# Altium project WPT 5V DC DC Converter Round 1.PrjPcb
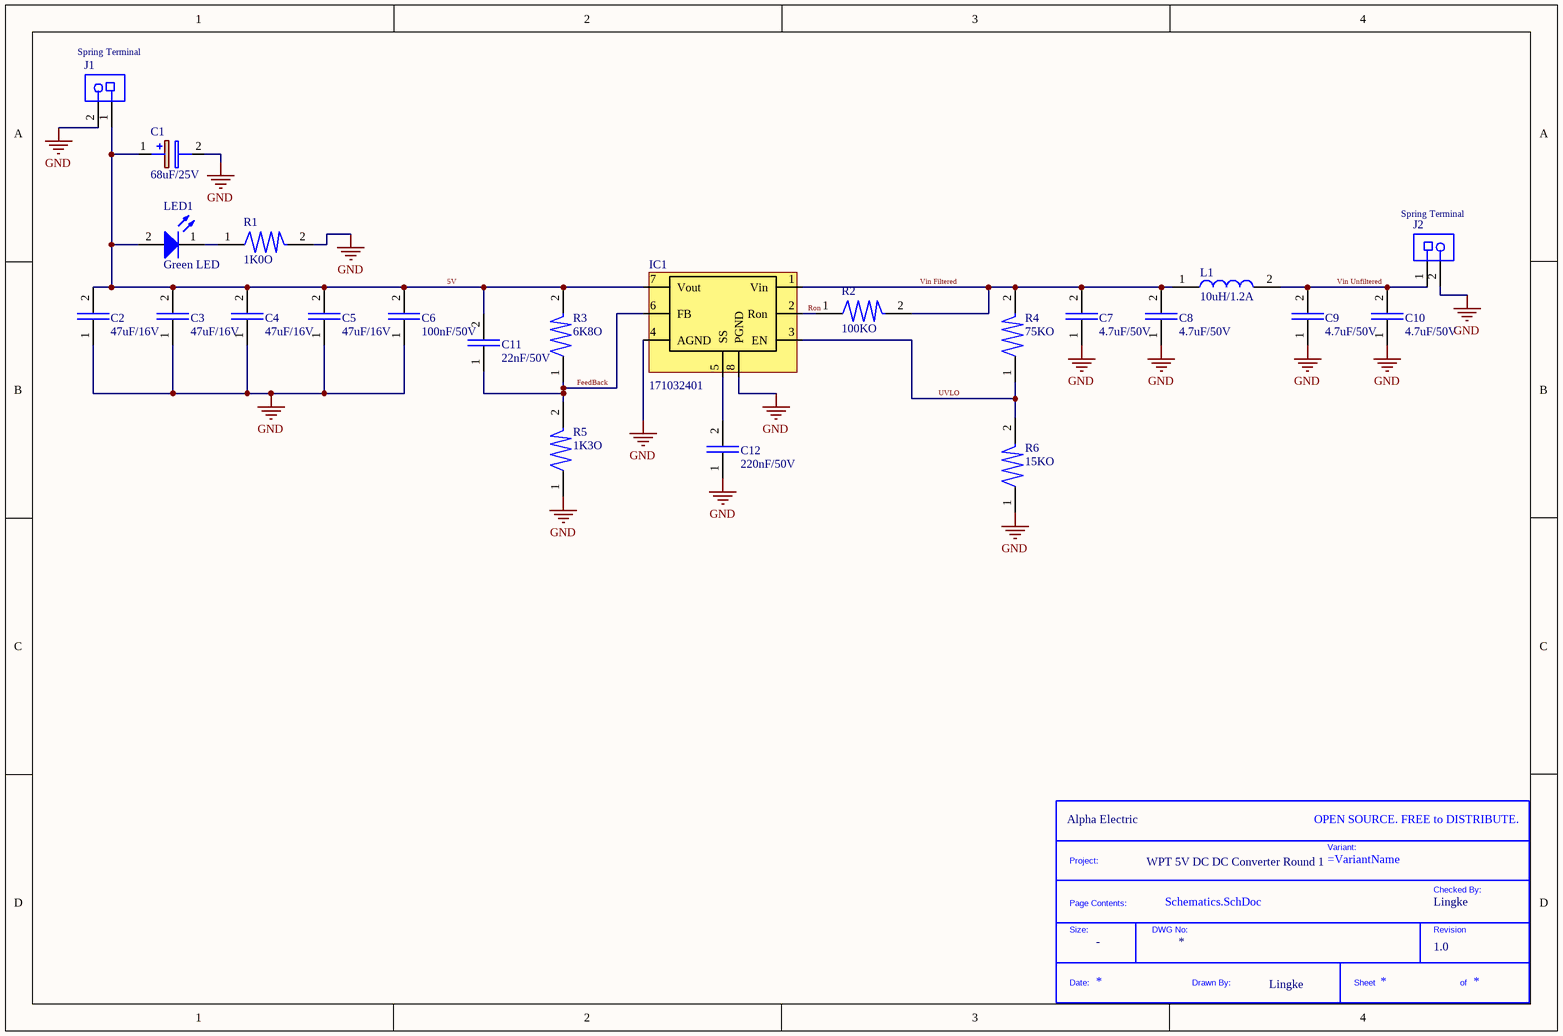
[diagram p0: Schematics.SchDoc]
1 sheet, 24 parts. Net scope: global (net labels, ports and power ports of the same name join across sheets).
Board file: Layout.PcbDoc

## Sheet Schematics.SchDoc
size A4

### Parts
*  Project Name: WPT 5V DC DC Converter Round 1  Company: Alpha Electric  Drawn By: Lingke  Revision: 1.0  (hidden comment: Title_Block)  (no BOM)
C1  68uF/25V  [CAPAE830X1170N]
C2  47uF/16V  [CAPC3225X280N]
C3  47uF/16V  [CAPC3225X280N]
C4  47uF/16V  [CAPC3225X280N]
C5  47uF/16V  [CAPC3225X280N]
C6  100nF/50V  [CAPC3216X90N]
C7  4.7uF/50V  [CAPC3225X280N]
C8  4.7uF/50V  [CAPC3225X280N]
C9  4.7uF/50V  [CAPC3225X280N]
C10  4.7uF/50V  [CAPC3225X280N]
C11  22nF/50V  [CAPC2012X90N]
C12  220nF/50V  [CAPC2012X90N]
IC1  171032401  [7 PIN PFM]
J1  Spring Terminal  [691411510002]
J2  Spring Terminal  [691411510002]
L1  10uH/1.2A  [WE-MAPI_3020]
LED1  Green LED  [0805_A]
R1  1K0O  [FP-CRCW0805-e3-MFG]
R2  100KO  [FP-CRCW0805-e3-MFG]
R3  6K8O  [FP-CRCW0805-e3-MFG]
R4  75KO  [FP-CRCW0805-e3-MFG]
R5  1K3O  [FP-CRCW0805-e3-MFG]
R6  15KO  [FP-CRCW0805-e3-MFG]

### Nets
GND: C1.2(-) C2.1 C3.1 C4.1 C5.1 C6.1 C7.1 C8.1 C9.1 C10.1 C12.1 IC1.4(AGND) IC1.8(PGND) J1.2 J2.2 R1.2 R5.1 R6.1
5V: C1.1(+) C2.2 C3.2 C4.2 C5.2 C6.2 C11.2 IC1.7(Vout) J1.1 LED1.2(A) R3.2
FeedBack: C11.1 IC1.6(FB) R3.1 R5.2
Ron: IC1.2(Ron) R2.1
UVLO: IC1.3(EN) R4.1 R6.2
Vin Filtered: C7.2 C8.2 IC1.1(Vin) L1.1 R2.2 R4.2
Vin Unfiltered: C9.2 C10.2 J2.1 L1.2
NetC12_2: C12.2 IC1.5(SS)
NetLED1_1: LED1.1(K) R1.1

### Notes on the sheet
- (in symbol Title_Block) OPEN SOURCE. FREE to DISTRIBUTE.; Variant:; Project:; Checked By:; Page Contents:; Size:; DWG No:; Revision; Date:; Drawn By:; Sheet; of

### Library data of the parts
* = Title_Block: Standard Title Block.; DWG No: *; Size: -; Checked By: Lingke
C1 = 875075555003: Capacitor Polarised; Manufacturer_Name: Wurth Elektronik; Datasheet Link: http://katalog.we-online.com/pbs/datasheet/875075555003.pdf; Height: 11.7mm; Manufacturer_Part_Number: 875075555003; Supplier 1: Mouser; Supplier Part Number 1: 710-875075555003
C2-C5 = EMK325ABJ476MMHP: Capacitor 47uF/16V; Supplier 1: Mouser; Supplier Part Number 1: 963-EMK325ABJ476MMHP
C6 = 885012208087: Capacitor 100nF/50V; Manufacturer_Name: Wurth Elektronik; Datasheet Link: https://componentsearchengine.com//885012208087.pdf; Height: 0.9mm; Mouser2 Part Number: 710-885012208087; Mouser2 Price/Stock: https://www.mouser.com/Search/Refine.aspx?Keyword=710-885012208087; Manufacturer_Part_Number: 885012208087; Supplier 1: Mouser; Supplier Part Number 1: 710-885012208087
C7-C10 = 885012209048: Capacitor 4.7uF/50V; Manufacturer_Name: Wurth Elektronik; Datasheet Link: https://katalog.we-online.com/pbs/datasheet/885012209048.pdf; Height: 2.8mm; Manufacturer_Part_Number: 885012209048; Supplier 1: Mouser; Supplier Part Number 1: 710-885012209048
C11 = 885012207094: Capacitor 22nF/50V; Manufacturer_Name: Wurth Elektronik; Datasheet Link: https://componentsearchengine.com//885012207094.pdf; Height: 0.9mm; Mouser2 Part Number: 710-885012207094; Mouser2 Price/Stock: https://www.mouser.com/Search/Refine.aspx?Keyword=710-885012207094; Manufacturer_Part_Number: 885012207094; Supplier 1: Mouser; Supplier Part Number 1: 710-885012207094
C12 = 885012207100: Capacitor 220nF / 50V; Supplier 1: Mouser; Supplier Part Number 1: 710-885012207100
IC1 = 171032401: MagI³C-VDRM Variable Step Down Regulator Module WE-VDRM , Ui=6-42V; Manufacturer: Wuerth Elektronik; Ui: 6-42 V; ComponentLink1Description: Manufacturer URL; ComponentLink2Description: Datasheet; ComponentLink1URL: http://www.we-online.com; ComponentLink2URL: http://katalog-live.we-online.de/pm/datasheet/171032401.pdf; PartNumber: 171032401; PackageReference: 7 PIN PFM; Supplier 1: Mouser; Supplier Part Number 1: 710-171032401
J1 J2 = 691411510002: Serie 4115 - 5.08mm Screwless Horizontal Entry WR-TBL, 2 pin; Manufacturer: Wurth Elektronik; Pin Number: 2; Datasheet URL: http://katalog.we-online.de/em/datasheet/6914115100XX.pdf; Part Number: 691411510002; Pitch: 5.08mm; Operating Temperature: -30to120degC; Packaging: Box; Package Reference: 691411510002; Publisher: WurthElektronik; Manufacturer URL: http://www.we-online.de; Mounting Technology: THT; Supplier 1: Mouser; Supplier Part Number 1: 710-691411510002
L1 = 74438336100: Inductor; Manufacturer_Name: Wurth Elektronik; Datasheet Link: http://katalog.we-online.de/pbs/datasheet/74438336100.pdf; Manufacturer_Part_Number: 74438336100; Supplier 1: Mouser; Supplier Part Number 1: 710-74438336100
LED1 = 150080GS75000: SMD mono-color Chip LED, WL-SMCW, Green; Manufacturer: Wuerth Elektronik; PackageReference: 0805_A; Color: Green; PartNumber: 150080GS75000; ComponentLink2URL: http://katalog.we-online.com/led/datasheet/150080GS75000.pdf; ComponentLink1URL: http://www.we-online.com; ComponentLink1Description: Manufacturer URL; ComponentLink2Description: Datasheet; Supplier 1: Mouser; Supplier Part Number 1: 710-150080GS75000
R1 = CRCW08051K00FKEAC: Resistor 1K0 Ohm; Number of Terminations: 2; Supplier 1: Mouser; Supplier Part Number 1: 71-CRCW0805-1.0K-E3
R2 = CRCW0805100KFKEB: Resistor 100K Ohm; Number of Terminations: 2; Supplier 1: Mouser; Supplier Part Number 1: 71-CRCW0805100KFKEB
R3 = CRCW08056K80FKEA: Resistor 6K8 Ohm; Number of Terminations: 2; Supplier 1: Mouser; Supplier Part Number 1: 71-CRCW0805-6.8K-E3
R4 = CRCW080575K0FKEB: Resistor 75K Ohm; Number of Terminations: 2; Supplier 1: Mouser; Supplier Part Number 1: 71-CRCW080575K0FKEB
R5 = CRCW08051K30FKEB: Resistor 1K3 Ohm; Number of Terminations: 2; Supplier 1: Mouser; Supplier Part Number 1: 71-CRCW08051K30FKEB
R6 = CRCW080515K0FKEB: Resistor 15K Ohm; Number of Terminations: 2; Supplier 1: Mouser; Supplier Part Number 1: 71-CRCW080515K0FKEB